# EAGLE design PCB_2.1 (EAGLE 8.6.3)
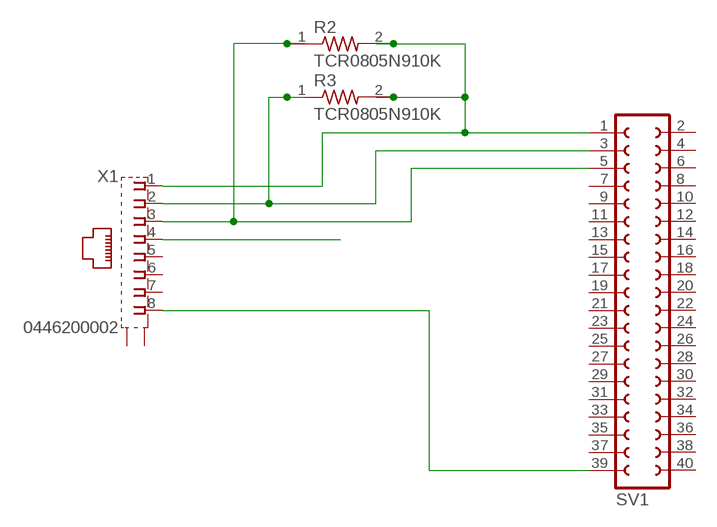
[diagram p0: schematic, sheet 1]

## Parts
R2  TCR0805N910K  [RESC2012X65N]
R3  TCR0805N910K  [RESC2012X65N]
SV1  FE20-2  [FE20-2]
X1  0446200002  [0446200002]

## Nets
3V3: R2.2 R3.2 SV1.1 X1.1
GND: SV1.39 X1.8
N$1: X1.4
SCL: R2.1 SV1.5 X1.3
SDA: R3.1 SV1.3 X1.2
Unconnected: SV1.2 SV1.4 SV1.6 SV1.7 SV1.8 SV1.9 SV1.10 SV1.11 SV1.12 SV1.13 SV1.14 SV1.15 SV1.16 SV1.17 SV1.18 SV1.19 SV1.20 SV1.21 SV1.22 SV1.23 SV1.24 SV1.25 SV1.26 SV1.27 SV1.28 SV1.29 SV1.30 SV1.31 SV1.32 SV1.33 SV1.34 SV1.35 SV1.36 SV1.37 SV1.38 SV1.40 X1.5 X1.6 X1.7 X1.S@1(S1) X1.S@2(S2)

## Library data of the parts
R2 R3 = TCR0805N910K:TCR0805N910K: Res Thick Film 0805 910K Ohm -10% to 0% 1/10W ±200ppm/°C Molded SMD T/R; AVAILABILITY: Unavailable; COMMENT: 1623707-7; DESCRIPTION: Res Thick Film 0805 910K Ohm -10% to 0% 1/10W ±200ppm/°C Molded SMD T/R; MF: TE Connectivity; MP: TCR0805N910K; PACKAGE: 0805 TE Connectivity; PRICE: None; TE_PURCHASE_URL: https://www.te.com/usa-en/product-1623707-7.html?te_bu=Cor&te_type=disp&te_campaign=seda_glo_cor-seda-global-disp-prtnr-fy19-seda-model-bom-cta_sma-317_1&elqCampaignId=32493
SV1 = con-lsta:FE20-2: FEMALE HEADER; OC_FARNELL: unknown; OC_NEWARK: unknown
X1 = 0446200002:0446200002: RJ-45 INVERTED MODULAR JACK ASSEMBLY WITH RJ-11 KEEPOUT FEATURE Source: Data sheet <http://www.farnell.com/datasheets/73207.pdf> MOLEX 0446200002 BUCHSE, RJ45, GESCHIRMT Source: Farnell <http://de.farnell.com/molex/0446200002/buchse-rj45-geschirmt/dp/9251910?ost=9251910>; AVAILABILITY: Unavailable; DESCRIPTION: Conn RJ-45 RCP 8 POS 2.04mm Solder RA Thru-Hole 8 Terminal 1 Port Tray Cat 3; MF: Molex, LLC; MP: 0446200002; PACKAGE: None; PRICE: None

## Module BUZZER
Ports: 

### Library data of the parts

## Board
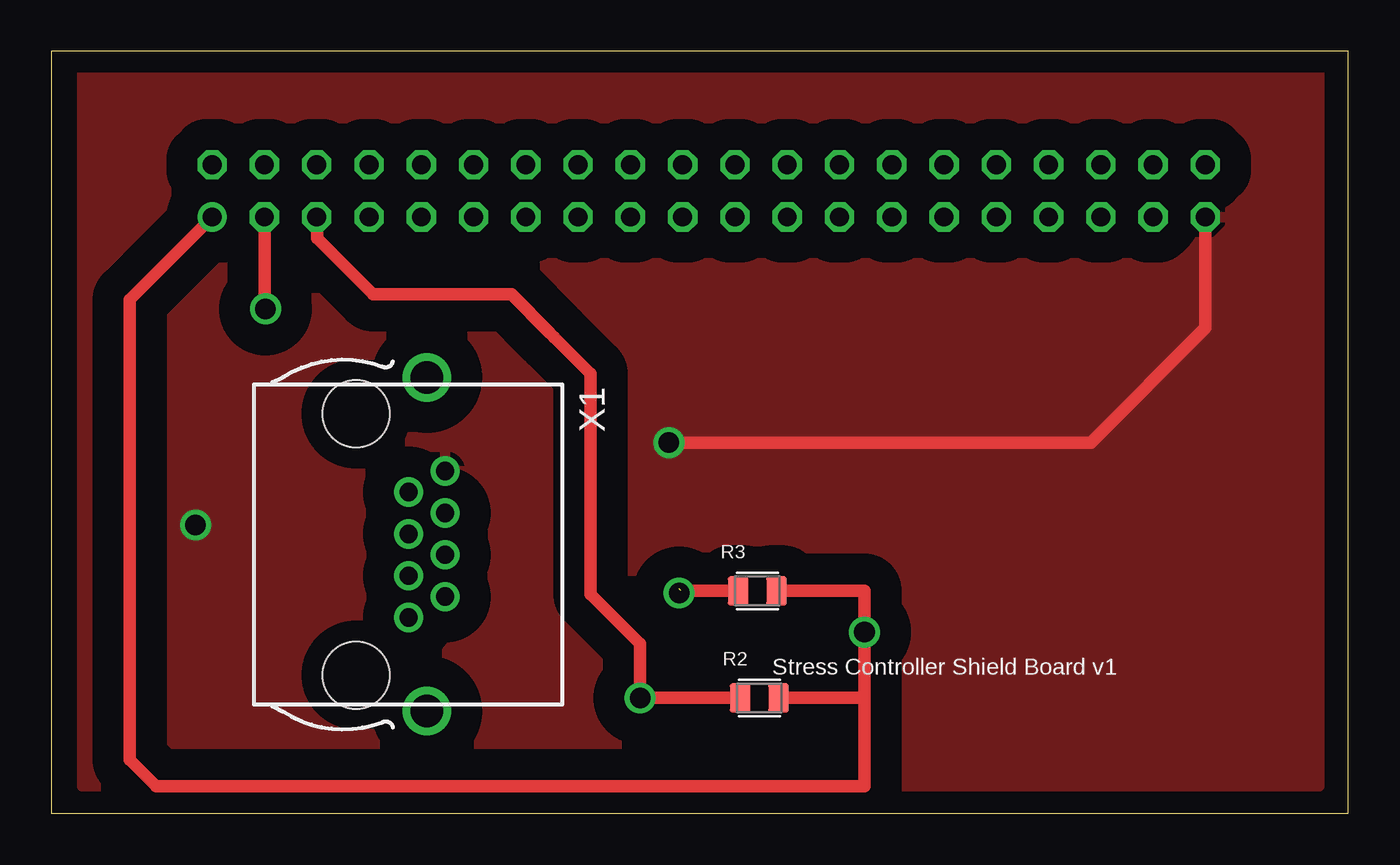
[diagram p1: board, top side]
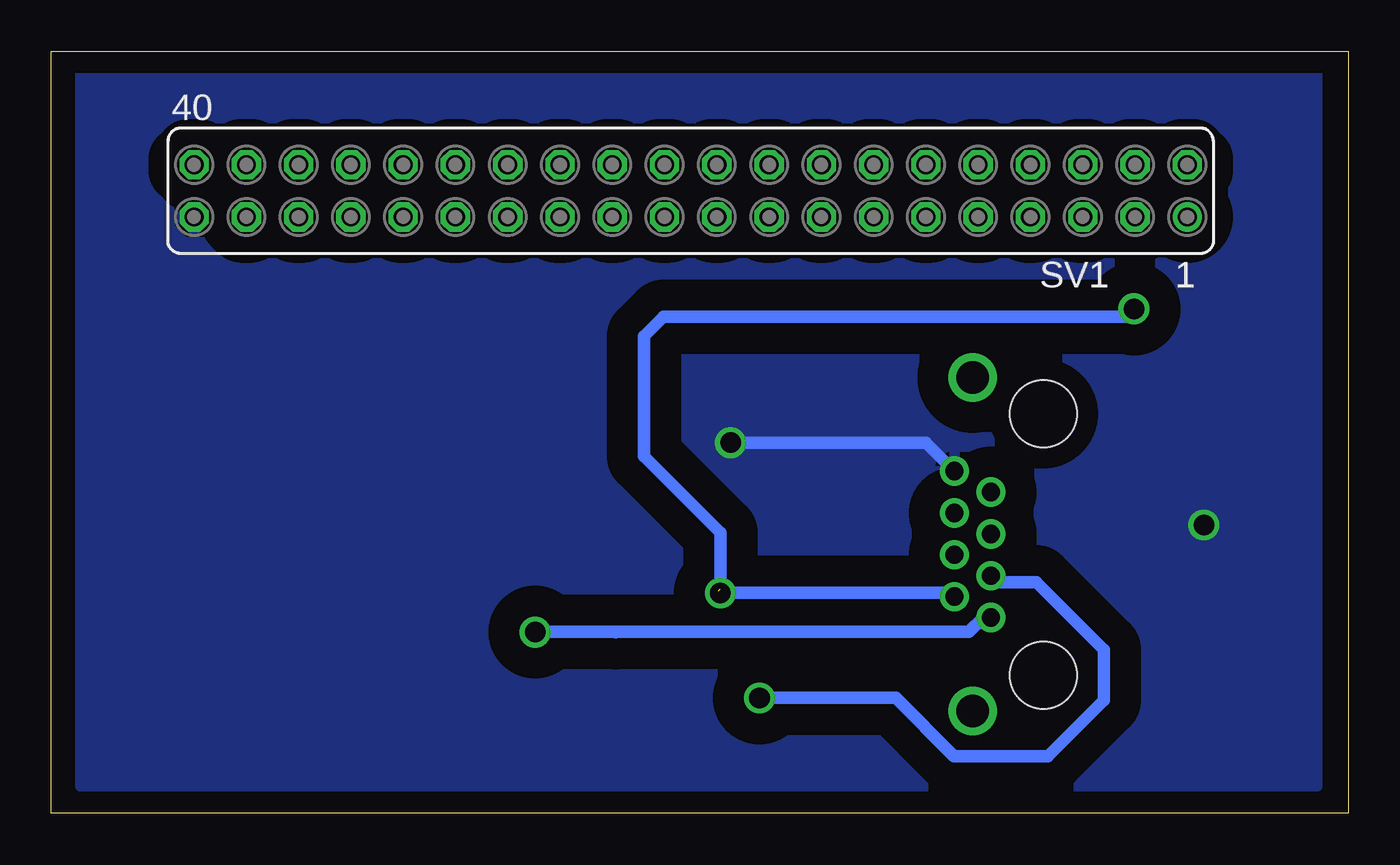
[diagram p2: board, bottom side, seen from below]

Size 63 x 37 mm. Coordinates in mm from the lower left corner, seen from the top.
Outline: 0,0 63,0 63,37 0,37 0,0
Copper layers (1*16): Top 0.035mm / dielectric 1.5mm / Bottom 0.035mm
Design rules "default *": minimum track width 0.6mm, minimum drill 0.35mm, track to track 1.5mm, track to pad 1.5mm, pad to pad 1mm, via to via 1mm, smd to smd 6mil, copper to edge 40mil, drill to drill 6mil, minimum pad ring 10mil, minimum via ring 8mil, stop-mask expansion 4mil, vias tented up to drill 0mil, thermal gap 10mil

### Footprints (pad centres in the part's own frame; a part is rotated, then mirrored left to right if it is on the bottom)
RESC2012X65N = smd 1 x 1.42: 1 -0.935,0; 2 0.935,0
FE20-2 = drill 0.914: 1 -24.13,1.27 | drill 0.914 octagon: 2 -24.13,-1.27; 3 -21.59,1.27; 4 -21.59,-1.27; 5 -19.05,1.27; 6 -19.05,-1.27; 7 -16.51,1.27; 8 -16.51,-1.27; 9 -13.97,1.27; 10 -13.97,-1.27; 11 -11.43,1.27; 12 -11.43,-1.27; 13 -8.89,1.27; 14 -8.89,-1.27; 15 -6.35,1.27; 16 -6.35,-1.27; 17 -3.81,1.27; 18 -3.81,-1.27; 19 -1.27,1.27; 20 -1.27,-1.27; 21 1.27,1.27; 22 1.27,-1.27; 23 3.81,1.27; 24 3.81,-1.27; 25 6.35,1.27; 26 6.35,-1.27; 27 8.89,1.27; 28 8.89,-1.27; 29 11.43,1.27; 30 11.43,-1.27; 31 13.97,1.27; 32 13.97,-1.27; 33 16.51,1.27; 34 16.51,-1.27; 35 19.05,1.27; 36 19.05,-1.27; 37 21.59,1.27; 38 21.59,-1.27; 39 24.13,1.27; 40 24.13,-1.27
0446200002 = drill 0.889 pad 1.422: 1 3.556,2.54; 2 2.54,4.318; 3 1.524,2.54; 4 0.508,4.318; 5 -0.508,2.54; 6 -1.524,4.318; 7 -2.54,2.54; 8 -3.556,4.318 | drill 1.575 pad 2.286: S@1 -8.103,3.429; S@2 8.103,3.429 | hole 3.251: 6.35,0; -6.35,0

### Placement (x,y rotation side)
R2  34.4,5.6 0 top
R3  34.3,10.8 0 top
SV1  31.94,30.23 180 bottom
X1  14.81,13.06 270 top

### Tracks (layer width: path | path; a pad name or v marks a point on that pad's centre or on a via)
3V3  (via drill 1)
  Top 0.61: 39.5,5.6 39.5,1.32 5.08,1.32 3.8,2.6 3.8,24.95 SV1.1 | R3.2 39.5,10.8 v39.5,8.8 39.5,5.6 | R2.2 39.5,5.6
  Bottom 0.61: X1.1 17.72,9.5 18.42,8.8 35.6,8.8 | 35.6,8.8 | 35.6,8.8 v39.5,8.8
GND  (via drill 1)
  Top 0.61: SV1.39 56.07,23.57 50.5,18 v30,18
  Bottom 0.61: v30,18 20.51,18 X1.8
  other vias: 7,14
  pour Top: 1.5,36 1.5,1.3 61.6,1.3 61.6,36
  pour Bottom: 1.5,36 1.5,1.3 61.6,1.3 61.6,36
SCL  (via drill 1)
  Top 0.61: R2.1 v28.6,5.6 28.6,8.23 26.2,10.63 26.2,21.35 24.42,23.12 24.2,23.35 22.35,25.2 15.63,25.2 12.91,27.92 12.91,28.94 SV1.5
  Bottom 0.61: v28.6,5.6 21.97,5.6 19.14,2.77 14.58,2.77 11.86,5.49 11.86,7.93 15.15,11.22 17.03,11.22 X1.3
SDA  (via drill 1)  (1 unrouted)
  Top 0.61: 10.4,28.96 SV1.3 10.35,24.5 v10.4,24.5 | R3.1 30.6,10.8 v30.5,10.7
  Bottom 0.61: 19.13,10.7 X1.2 19.31,10.7 v30.5,10.7 | v10.4,24.5 10.4,24.11 33.27,24.11 34.21,23.17 34.21,17.33 30.5,13.63 30.5,10.91

### Text on the board
tPlace: Stress Controller Shield Board v1